# Altium project Sophia_Lake.PrjPcb (part 4 of 4)
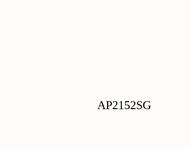
[diagram p12: Breakout_FPGA.SchDoc, right]

## Nets that join several sheets
0V85: Power (R47.2 R48.1 T5.2), SoC (R141.2)
1V0: Power (5 pins), FPGA (62 pins)
1V2: Power (R40.2 R41.1 T3.2), SoC (R140.2)
1V8: Power (7 pins), FPGA (15 pins)
1V35: Power (C20.2 C21.1 R36.2 U8.6), FPGA (26 pins), DDR (72 pins)
3V3: Breakout_SoC (53 pins), Power (25 pins), SODIMM (6 pins), FPGA (60 pins), DDR (C148.1 R83.1 U19.7 U19.10), SoC (39 pins), Breakout_FPGA (21 pins)
5V0: Power (19 pins), FPGA (D2.1), SoC (D3.1)
GND: Main (M1.1 M2.1 M3.1 M4.1), Breakout_SoC (27 pins), Power (63 pins), SODIMM (70 pins), FPGA (238 pins), DDR (105 pins), SoC (56 pins), Breakout_FPGA (13 pins)
VCORE: SODIMM (6 pins), SoC (R139.2 R141.1)
VIO: Breakout_SoC (10 pins), SODIMM (J4.251 J4.252 J4.253 J4.254), FPGA (26 pins), SoC (7 pins)
BOOT_SEL: SODIMM (J4.234), SoC (C226.1 R134.1 SW10.4)
DDR_A0: FPGA (U14.V5), DDR (R100.2 U18.N3 U20.N3)
DDR_A1: FPGA (U14.Y1), DDR (R94.2 U18.P7 U20.P7)
DDR_A2: FPGA (U14.V4), DDR (R101.2 U18.P3 U20.P3)
DDR_A3: FPGA (U14.Y4), DDR (R99.2 U18.N2 U20.N2)
DDR_A4: FPGA (U14.AA1), DDR (R88.2 U18.P8 U20.P8)
DDR_A5: FPGA (U14.AA4), DDR (R102.2 U18.P2 U20.P2)
DDR_A6: FPGA (U14.AB1), DDR (R92.2 U18.R8 U20.R8)
DDR_A7: FPGA (U14.Y6), DDR (R96.2 U18.R2 U20.R2)
DDR_A8: FPGA (U14.AB5), DDR (R91.2 U18.T8 U20.T8)
DDR_A9: FPGA (U14.W1), DDR (R98.2 U18.R3 U20.R3)
DDR_A10: FPGA (U14.U3), DDR (R107.2 U18.L7 U20.L7)
DDR_A11: FPGA (U14.AB2), DDR (R95.2 U18.R7 U20.R7)
DDR_A12: FPGA (U14.AA3), DDR (R93.2 U18.N7 U20.N7)
DDR_A13: FPGA (U14.W2), DDR (R97.2 U18.T3 U20.T3)
DDR_A14: FPGA (U14.W5), DDR (U18.T7 U20.T7)
DDR_A15: FPGA (U14.AA5), DDR (U18.M7 U20.M7)
DDR_BA0: FPGA (U14.W4), DDR (R106.2 U18.M2 U20.M2)
DDR_BA1: FPGA (U14.AB3), DDR (R89.2 U18.N8 U20.N8)
DDR_BA2: FPGA (U14.U5), DDR (R105.2 U18.M3 U20.M3)
DDR_CAS: FPGA (U14.T5), DDR (R109.2 U18.K3 U20.K3)
DDR_CKE: FPGA (U14.W6), DDR (R90.2 U18.K9 U20.K9)
DDR_CLK_N: FPGA (U14.R2), DDR (R86.1 R113.1 U18.K7 U20.K7)
DDR_CLK_P: FPGA (U14.R3), DDR (R86.2 R113.2 U18.J7 U20.J7)
DDR_CS: FPGA (U14.V2), DDR (R104.2 R112.2 U18.L2 U20.L2)
DDR_D0: FPGA (U14.N4), DDR (U18.E3)
DDR_D1: FPGA (U14.P1), DDR (U18.F7)
DDR_D2: FPGA (U14.N5), DDR (U18.F2)
DDR_D3: FPGA (U14.R1), DDR (U18.F8)
DDR_D4: FPGA (U14.M5), DDR (U18.H3)
DDR_D5: FPGA (U14.P6), DDR (U18.H8)
DDR_D6: FPGA (U14.M6), DDR (U18.G2)
DDR_D7: FPGA (U14.N2), DDR (U18.H7)
DDR_D8: FPGA (U14.K6), DDR (U18.D7)
DDR_D9: FPGA (U14.J4), DDR (U18.C3)
DDR_D10: FPGA (U14.L5), DDR (U18.C8)
DDR_D11: FPGA (U14.K4), DDR (U18.C2)
DDR_D12: FPGA (U14.L3), DDR (U18.A7)
DDR_D13: FPGA (U14.M2), DDR (U18.A2)
DDR_D14: FPGA (U14.M3), DDR (U18.B8)
DDR_D15: FPGA (U14.K3), DDR (U18.A3)
DDR_D16: FPGA (U14.B1), DDR (U20.E3)
DDR_D17: FPGA (U14.F1), DDR (U20.F7)
DDR_D18: FPGA (U14.A1), DDR (U20.F2)
DDR_D19: FPGA (U14.E2), DDR (U20.F8)
DDR_D20: FPGA (U14.D2), DDR (U20.H3)
DDR_D21: FPGA (U14.G1), DDR (U20.H8)
DDR_D22: FPGA (U14.B2), DDR (U20.G2)
DDR_D23: FPGA (U14.F3), DDR (U20.H7)
DDR_D24: FPGA (U14.K1), DDR (U20.D7)
DDR_D25: FPGA (U14.J5), DDR (U20.C3)
DDR_D26: FPGA (U14.H2), DDR (U20.C8)
DDR_D27: FPGA (U14.H5), DDR (U20.C2)
DDR_D28: FPGA (U14.G2), DDR (U20.A7)
DDR_D29: FPGA (U14.H4), DDR (U20.A2)
DDR_D30: FPGA (U14.J1), DDR (U20.B8)
DDR_D31: FPGA (U14.H3), DDR (U20.A3)
DDR_DQM0: FPGA (U14.P2), DDR (U18.E7)
DDR_DQM1: FPGA (U14.J6), DDR (U18.D3)
DDR_DQM2: FPGA (U14.C2), DDR (U20.E7)
DDR_DQM3: FPGA (U14.G3), DDR (U20.D3)
DDR_DQS0_N: FPGA (U14.P4), DDR (U18.G3)
DDR_DQS0_P: FPGA (U14.P5), DDR (U18.F3)
DDR_DQS1_N: FPGA (U14.L1), DDR (U18.B7)
DDR_DQS1_P: FPGA (U14.M1), DDR (U18.C7)
DDR_DQS2_N: FPGA (U14.D1), DDR (U20.G3)
DDR_DQS2_P: FPGA (U14.E1), DDR (U20.F3)
DDR_DQS3_N: FPGA (U14.J2), DDR (U20.B7)
DDR_DQS3_P: FPGA (U14.K2), DDR (U20.C7)
DDR_ODT: FPGA (U14.U2), DDR (R103.2 U18.K1 U20.K1)
DDR_RAS: FPGA (U14.R6), DDR (R110.2 U18.J3 U20.J3)
DDR_RST: FPGA (U14.Y8), DDR (R87.2 U18.T2 U20.T2)
DDR_WE: FPGA (U14.U6), DDR (R108.2 U18.L3 U20.L3)
FPGA_B0: FPGA (U14.Y19), Breakout_FPGA (R158.2 SW8.1)
FPGA_B1: FPGA (U14.Y21), Breakout_FPGA (R159.2 SW9.1)
FPGA_LED0: FPGA (U14.V18), Breakout_FPGA (R152.2)
FPGA_LED1: FPGA (U14.Y18), Breakout_FPGA (R155.2)
FPGA_LED2: FPGA (U14.P19), Breakout_FPGA (R153.2)
FPGA_LED3: FPGA (U14.U20), Breakout_FPGA (R156.2)
FPGA_SCL: Power (R136.1 U11.10), FPGA (U14.AB18)
FPGA_SDA: Power (R137.1 U11.9), FPGA (U14.AA18)
GPIO0_1V2: Breakout_SoC (U3.10), SODIMM (J4.145)
GPIO1_1V2: Breakout_SoC (U3.9), SODIMM (J4.148)
GPIO2_1V2: Breakout_SoC (U3.8), SODIMM (J4.149)
GPIO3_1V2: Breakout_SoC (U3.7), SODIMM (J4.150)
GPIO8_1V2: Breakout_SoC (U3.6), SODIMM (J4.157)
GPIO9_1V2: Breakout_SoC (U3.5), SODIMM (J4.160)
GPIO10_1V2: Breakout_SoC (U3.4), SODIMM (J4.161)
GPIO11_1V2: Breakout_SoC (U3.3), SODIMM (J4.162)
GPIO12_1V2: Breakout_SoC (U4.4), SODIMM (J4.163)
GPIO13_1V2: Breakout_SoC (U4.6), SODIMM (J4.166)
GPIO14_1V2: Breakout_SoC (U4.3), SODIMM (J4.167)
GPIO15_1V2: Breakout_SoC (U4.5), SODIMM (J4.168)
GPIO16_1V2: Breakout_SoC (U5.10), SODIMM (J4.169)
GPIO17_1V2: Breakout_SoC (U5.9), SODIMM (J4.172)
GPIO18_1V2: Breakout_SoC (U5.8), SODIMM (J4.173)
GPIO19_1V2: Breakout_SoC (U5.7), SODIMM (J4.174)
GPIO20_1V2: Breakout_SoC (U5.6), SODIMM (J4.175)
GPIO21_1V2: Breakout_SoC (U5.5), SODIMM (J4.178)
GPIO22_1V2: Breakout_SoC (U5.4), SODIMM (J4.179)
GPIO23_1V2: Breakout_SoC (U5.3), SODIMM (J4.180)
GPIO24_1V2: Breakout_SoC (U6.10), SODIMM (J4.181)
GPIO25_1V2: Breakout_SoC (U6.9), SODIMM (J4.182)
GPIO26_1V2: Breakout_SoC (U6.8), SODIMM (J4.183)
GPIO27_1V2: Breakout_SoC (U6.7), SODIMM (J4.184)
GPIO28_1V2: Breakout_SoC (U6.6), SODIMM (J4.185)
GPIO29_1V2: Breakout_SoC (U6.5), SODIMM (J4.186)
GPIO30_1V2: Breakout_SoC (U6.4), SODIMM (J4.187)
GPIO31_1V2: Breakout_SoC (U6.3), SODIMM (J4.188)
I2C0_SCL: Breakout_SoC (U1.5), SODIMM (J4.196)
I2C0_SDA: Breakout_SoC (U1.6), SODIMM (J4.198)
I2C1_SCL: Breakout_SoC (U1.3), SODIMM (J4.192)
I2C1_SDA: Breakout_SoC (U1.4), SODIMM (J4.194)
JTAG_TCK: SODIMM (J4.212), SoC (U26.6)
JTAG_TDI: SODIMM (J4.214), SoC (U26.5)
JTAG_TDO: SODIMM (J4.216), SoC (U26.4)
JTAG_TMS: SODIMM (J4.218), SoC (U26.3)
JTAG_TRSTn: SODIMM (J4.210), SoC (U26.7)
PM_00_N: FPGA (U14.AA16), Breakout_FPGA (J7.5)
PM_00_P: FPGA (U14.Y16), Breakout_FPGA (J7.7)
PM_01_N: FPGA (U14.AB17), Breakout_FPGA (J7.9)
PM_01_P: FPGA (U14.AB16), Breakout_FPGA (J7.11)
PM_02_N: FPGA (U14.AB13), Breakout_FPGA (J7.6)
PM_02_P: FPGA (U14.AA13), Breakout_FPGA (J7.8)
PM_03_N: FPGA (U14.AB15), Breakout_FPGA (J7.10)
PM_03_P: FPGA (U14.AA15), Breakout_FPGA (J7.12)
PM_10_N: FPGA (U14.P17), Breakout_FPGA (J8.5)
PM_10_P: FPGA (U14.N17), Breakout_FPGA (J8.7)
PM_11_N: FPGA (U14.R16), Breakout_FPGA (J8.9)
PM_11_P: FPGA (U14.P15), Breakout_FPGA (J8.11)
PM_12_N: FPGA (U14.N14), Breakout_FPGA (J8.6)
PM_12_P: FPGA (U14.N13), Breakout_FPGA (J8.8)
PM_13_N: FPGA (U14.R17), Breakout_FPGA (J8.10)
PM_13_P: FPGA (U14.P16), Breakout_FPGA (J8.12)
QSPI0_CSn: SODIMM (J4.227), SoC (U21.5)
QSPI0_DQ0: SODIMM (J4.219), SoC (U21.9)
QSPI0_DQ1: SODIMM (J4.221), SoC (U21.8)
QSPI0_DQ2: SODIMM (J4.223), SoC (U21.7)
QSPI0_DQ3: SODIMM (J4.225), SoC (U21.6)
QSPI0_SCLK: SODIMM (J4.229), SoC (U21.4)
RESETn: SODIMM (J4.233), SoC (U26.8)
RESETn_3V3: FPGA (U14.V19), SoC (5 pins)
SD_CD: FPGA (U14.AB12), Breakout_FPGA (R142.4 R150.1 R151.1)
SD_CLK: FPGA (U14.W16), Breakout_FPGA (R147.4 R149.1)
SD_CMD: FPGA (U14.W15), Breakout_FPGA (R147.3 R148.1)
SD_D0: FPGA (U14.AB11), Breakout_FPGA (R142.1 R143.1)
SD_D1: FPGA (U14.AA11), Breakout_FPGA (R142.2 R144.1)
SD_D2: FPGA (U14.Y12), Breakout_FPGA (R145.1 R147.1)
SD_D3: FPGA (U14.Y14), Breakout_FPGA (R146.1 R147.2)
SOC_TL0: SODIMM (J4.3), FPGA (U14.F13)
SOC_TL1: SODIMM (J4.4), FPGA (U14.M13)
SOC_TL2: SODIMM (J4.5), FPGA (U14.E14)
SOC_TL3: SODIMM (J4.6), FPGA (U14.L13)
SOC_TL4: SODIMM (J4.9), FPGA (U14.C13)
SOC_TL5: SODIMM (J4.10), FPGA (U14.K13)
SOC_TL6: SODIMM (J4.11), FPGA (U14.A13)
SOC_TL7: SODIMM (J4.12), FPGA (U14.H13)
SOC_TL8: SODIMM (J4.15), FPGA (U14.A15)
SOC_TL9: SODIMM (J4.16), FPGA (U14.G13)
SOC_TL10: SODIMM (J4.17), FPGA (U14.A16)
SOC_TL11: SODIMM (J4.18), FPGA (U14.E13)
SOC_TL12: SODIMM (J4.21), FPGA (U14.M15)
SOC_TL13: SODIMM (J4.22), FPGA (U14.D14)
SOC_TL14: SODIMM (J4.23), FPGA (U14.L14)
SOC_TL15: SODIMM (J4.24), FPGA (U14.B13)
SOC_TL16: SODIMM (J4.27), FPGA (U14.L15)
SOC_TL17: SODIMM (J4.28), FPGA (U14.A14)
SOC_TL18: SODIMM (J4.29), FPGA (U14.J14)
SOC_TL19: SODIMM (J4.30), FPGA (U14.M16)
SOC_TL20: SODIMM (J4.33), FPGA (U14.L16)
SOC_TL21: SODIMM (J4.34), FPGA (U14.N19)
SOC_TL22: SODIMM (J4.35), FPGA (U14.K16)
SOC_TL23: SODIMM (J4.36), FPGA (U14.N18)
SOC_TL24: SODIMM (J4.39), FPGA (U14.G16)
SOC_TL25: SODIMM (J4.40), FPGA (U14.N20)
SOC_TL26: SODIMM (J4.41), FPGA (U14.F14)
SOC_TL27: SODIMM (J4.42), FPGA (U14.J15)
SOC_TL28: SODIMM (J4.45), FPGA (U14.G17)
SOC_TL29: SODIMM (J4.46), FPGA (U14.H14)
SOC_TL30: SODIMM (J4.47), FPGA (U14.F16)
SOC_TL31: SODIMM (J4.48), FPGA (U14.H15)
SOC_TL32: SODIMM (J4.51), FPGA (U14.G18)
SOC_TL33: SODIMM (J4.52), FPGA (U14.G15)
SOC_TL34: SODIMM (J4.53), FPGA (U14.B15)
SOC_TL35: SODIMM (J4.54), FPGA (U14.K17)
SOC_TL36: SODIMM (J4.57), FPGA (U14.B17)
SOC_TL37: SODIMM (J4.58), FPGA (U14.J17)
SOC_TL38: SODIMM (J4.59), FPGA (U14.A18)
SOC_TL39: SODIMM (J4.60), FPGA (U14.H17)
SOC_TL40: SODIMM (J4.63), FPGA (U14.B18)
SOC_TL41: SODIMM (J4.64), FPGA (U14.J20)
SOC_TL42: SODIMM (J4.65), FPGA (U14.A19)
SOC_TL43: SODIMM (J4.66), FPGA (U14.J19)
SOC_TL44: SODIMM (J4.69), FPGA (U14.B20)
SOC_TL45: SODIMM (J4.70), FPGA (U14.F20)
SOC_TL46: SODIMM (J4.71), FPGA (U14.A20)
SOC_TL47: SODIMM (J4.72), FPGA (U14.K19)
SOC_TL48: SODIMM (J4.75), FPGA (U14.B21)
SOC_TL49: SODIMM (J4.76), FPGA (U14.E16)
SOC_TL50: SODIMM (J4.77), FPGA (U14.A21)
SOC_TL51: SODIMM (J4.78), FPGA (U14.E17)
SOC_TL52: SODIMM (J4.81), FPGA (U14.D20)
SOC_TL53: SODIMM (J4.82), FPGA (U14.E18)
SOC_TL54: SODIMM (J4.83), FPGA (U14.B22)
SOC_TL55: SODIMM (J4.84), FPGA (U14.L18)
SOC_TL56: SODIMM (J4.87), FPGA (U14.C22)
SOC_TL57: SODIMM (J4.88), FPGA (U14.L19)
SOC_TL58: SODIMM (J4.89), FPGA (U14.E22)
SOC_TL59: SODIMM (J4.90), FPGA (U14.K18)
SOC_TL60: SODIMM (J4.91), FPGA (U14.E19)
SOC_TL61: SODIMM (J4.92), FPGA (U14.L20)
SOC_TL62: SODIMM (J4.93), FPGA (U14.F19)
SOC_TL63: SODIMM (J4.94), FPGA (U14.M20)
SOC_TL64: SODIMM (J4.95), FPGA (U14.G20)
SOC_TL65: SODIMM (J4.96), FPGA (U14.H22)
SOC_TL66: SODIMM (J4.97), FPGA (U14.G21)
SOC_TL67: SODIMM (J4.98), FPGA (U14.J21)
SOC_TL68: SODIMM (J4.99), FPGA (U14.H20)
SOC_TL69: SODIMM (J4.100), FPGA (U14.J22)
SOC_TL70: SODIMM (J4.101), FPGA (U14.H19)
SOC_TL71: SODIMM (J4.103), FPGA (U14.D21)
SOC_TL72: SODIMM (J4.104), FPGA (U14.K21)
SOC_TL73: SODIMM (J4.105), FPGA (U14.C19)
SOC_TL74: SODIMM (J4.106), FPGA (U14.N22)
SOC_TL75: SODIMM (J4.108), FPGA (U14.M18)
SOC_TL76: SODIMM (J4.109), FPGA (U14.C14)
SOC_TL77: SODIMM (J4.110), FPGA (U14.M22)
SOC_TL78: SODIMM (J4.111), FPGA (U14.C15)
SOC_TL79: SODIMM (J4.112), FPGA (U14.M21)
SOC_TL80: SODIMM (J4.114), FPGA (U14.L21)
SOC_TL81: SODIMM (J4.115), FPGA (U14.D16)
SOC_TL82: SODIMM (J4.116), FPGA (U14.K22)
SOC_TL83: SODIMM (J4.117), FPGA (U14.D17)
SOC_TL84: SODIMM (J4.118), FPGA (U14.B16)
SOC_TL85: SODIMM (J4.120), FPGA (U14.F18)
SOC_TL86: SODIMM (J4.121), FPGA (U14.C17)
SOC_TL87: SODIMM (J4.122), FPGA (U14.D22)
SOC_TL88: SODIMM (J4.123), FPGA (U14.C18)
SOC_TL89: SODIMM (J4.124), FPGA (U14.D19)
UART0_RX: SODIMM (J4.215), SoC (U26.9)
UART0_TX: SODIMM (J4.213), SoC (U26.10)
UART1_RX: Breakout_SoC (U1.10), SODIMM (J4.211)
UART1_TX: Breakout_SoC (U1.9), SODIMM (J4.209)
UART2_RX: Breakout_SoC (U1.8), SODIMM (J4.207)
UART2_TX: Breakout_SoC (U1.7), SODIMM (J4.205)

## Assembly variants
Production - 100T: not fitted R7 R30 R45
Production - 200T: not fitted R7 R30 R45; alternate parts U14 -> CMP-010-000000-1